# Altium schematic sheet 余先松  任务一.SchDoc
size A4
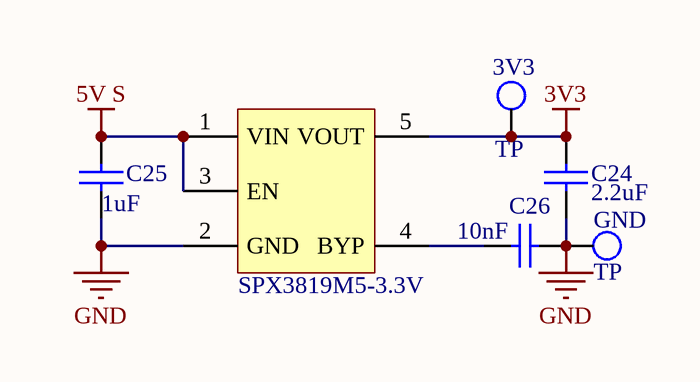
[diagram p0: 余先松  任务一.SchDoc]

## Parts
3V3  TP
?  SPX3819M5-3.3V  [SOT-23 L]
C24  2.2uF  [0603C]
C25  1uF  [0603C]
C26  10nF  [0603C]
GND  TP

## Nets
3V3: 3V3.10 ?.5(VOUT) C24.2
5V S: ?.1(VIN) ?.3(EN) C25.2
GND: ?.2(GND) C24.1 C25.1 C26.1 GND.10
Net?_4: ?.4(BYP) C26.2

## Library data of the parts
? = LDO_SOT23-5
C24-C26 = Cap: Capacitor; Value: 100pF; Published: 8-Jun-2000; LatestRevisionDate: 17-Jul-2002; LatestRevisionNote: Re-released for DXP Platform.; PackageReference: RAD-0.3; Publisher: Altium Limited; PackageDescription: Radial Cap, Thru-Hole; 2 Leads; 0.3 in Pin Spacing